# Altium project QAM16.PrjPcb (part 3 of 3)
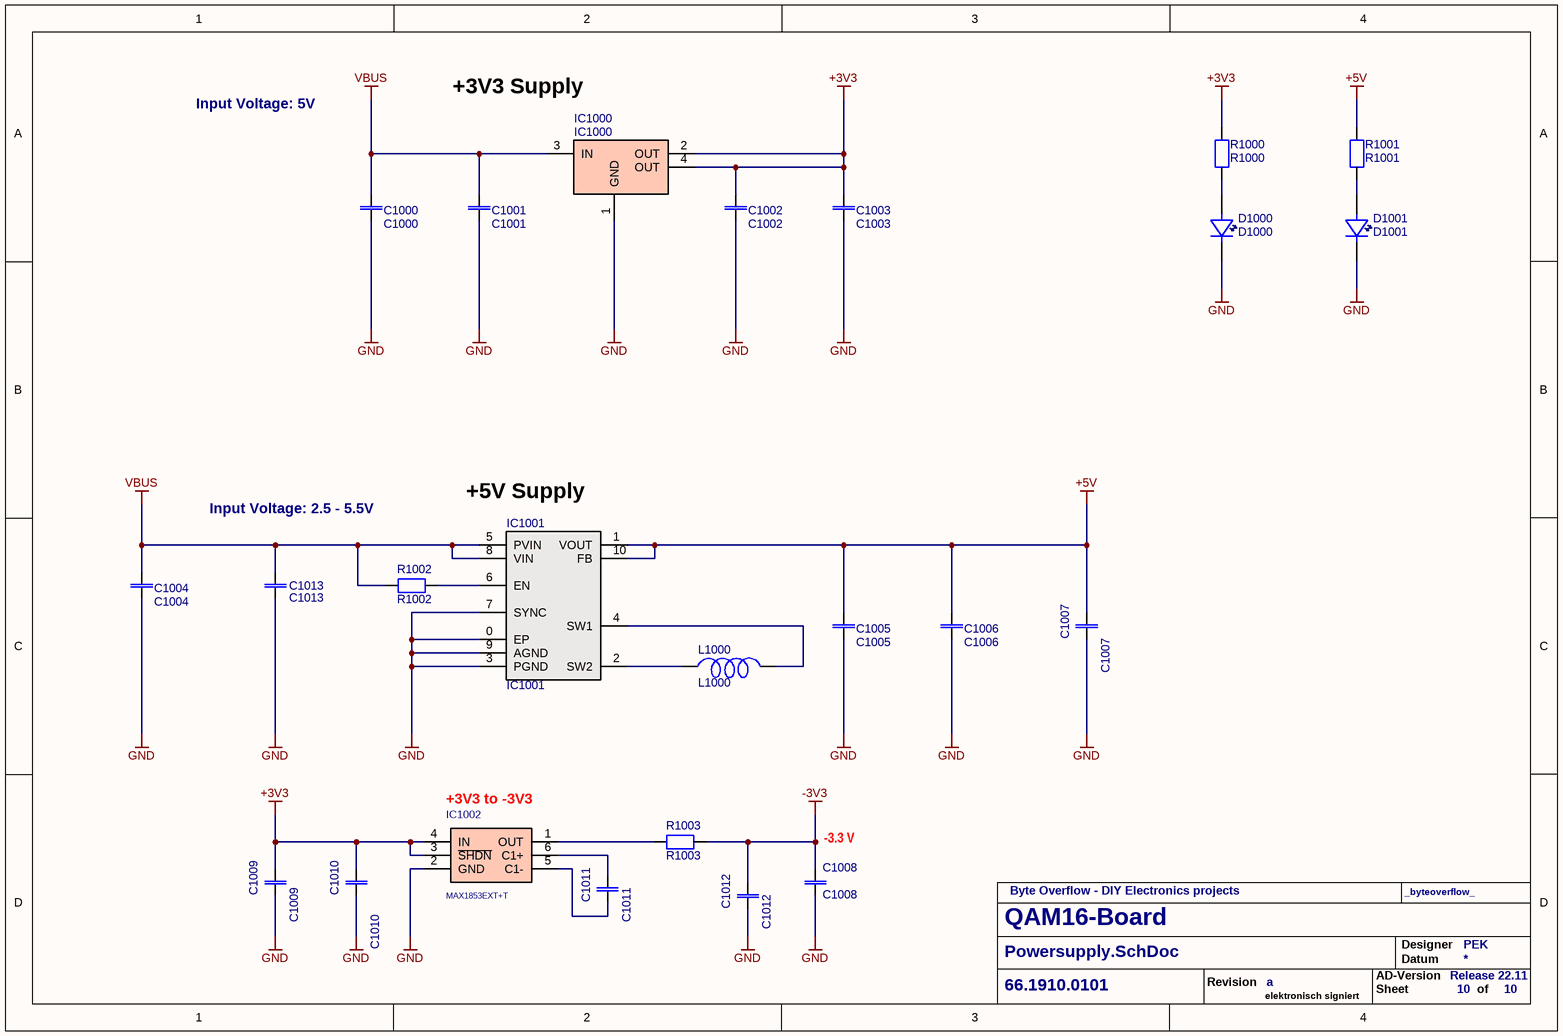
[diagram p10: Powersupply.SchDoc]

## Nets that join several sheets
+3V3: Buttons (R300.1 R301.1 R302.1 R303.1), Communication (C601.1 IC600.6 R602.2 R603.2), Connectors (12 pins), Display (14 pins), Sensors (5 pins), MCU (20 pins), Powersupply (9 pins)
+5V: ADC (R901.1), Connectors (D704.2 FE709.1 TP701.1), DAC (C810.1 FE801.2), MCU (C211.1 C213.1 IC201.1 IC203.14), Powersupply (6 pins)
+5V_AVCC: ADC (IC900.4), DAC (6 pins)
-3V3: DAC (C803.1 FE800.2), Powersupply (C1008.1 C1012.1 R1003.2)
-3V3_AVCC: ADC (IC900.11), Connectors (TP705.1), DAC (6 pins)
GND: MasterSheet (8 pins), ADC (C901.1 IC901.4 R908.1 R909.1), Buttons (8 pins), Communication (6 pins), Connectors (34 pins), DAC (14 pins), Display (32 pins), Sensors (5 pins), MCU (23 pins), Powersupply (21 pins)
VBUS: Communication (C600.1 IC600.7 R600.1), Connectors (6 pins), Powersupply (8 pins)
ADC_IN5: ADC (C900.2 IC900.8 R907.1), MCU (IC200.10)
ADC_IN6: DAC (R807.1), MCU (IC200.11)
BME_CS: Sensors (IC500.2), MCU (IC200.18)
BTN1: Buttons (C300.1 R304.2), MCU (IC200.38)
BTN2: Buttons (C301.1 R305.2), MCU (IC200.39)
BTN3: Buttons (C302.1 R306.2), MCU (IC200.40)
BTN4: Buttons (C303.1 R307.2), MCU (IC200.41)
DAC1_OUT: DAC (C801.1), MCU (IC200.14)
DISP_BL: Display (R406.2), MCU (IC200.25)
DISP_CS: Display (R401.2), MCU (IC200.29)
DISP_DC: Display (R400.2), MCU (IC200.31)
DISP_RST: Display (R405.2), MCU (IC200.30)
I2C1_SCL: Connectors (D700.2 FE704.1 R704.2), Sensors (IC501.2), MCU (IC200.45)
I2C1_SDA: Connectors (D700.1 FE703.1 R703.2), Sensors (IC501.1), MCU (IC200.46)
LED1: Connectors (R718.1 T702.1), MCU (R203.2)
LED2: Connectors (R719.1 T701.1), MCU (R203.4)
LED3: Connectors (R717.1 T700.1), MCU (R203.6)
NRST: Connectors (R709.1), MCU (C210.1 IC200.7)
SIG_IN: ADC (R904.1), Connectors (R706.2 R707.2)
SIG_OUT: Connectors (R705.2 R708.2), DAC (IC800.6 IC800.7 R806.2 R807.2)
SPI1_MISO: Sensors (IC500.5), MCU (IC200.16 IC202.2)
SPI1_MOSI: Sensors (IC500.3), MCU (IC200.17 IC202.5)
SPI1_SCK: Sensors (IC500.4), MCU (IC200.15 IC202.6)
SPI2_MOSI: Display (R404.2), MCU (IC200.28)
SPI2_SCK: Display (R403.2), MCU (IC200.26)
SWCLK: Connectors (R711.1), MCU (IC200.37)
SWDIO: Connectors (R710.1), MCU (IC200.34)
TP1: Connectors (D706.2 FE708.1 TP700.1), MCU (R206.2)
TP2: Connectors (D706.1 FE707.1 TP703.1), MCU (IC200.20)
TP4: Connectors (D701.2 FE702.1), MCU (IC200.33)
USART1_RX: Connectors (R715.1), MCU (IC200.43)
USART1_TX: Connectors (R713.1), MCU (IC200.42)
USART2_RX: Communication (IC600.18), MCU (IC200.13)
USART2_TX: Communication (IC600.17), MCU (IC200.12)
USART3_RX: Connectors (D707.2 FE712.1), MCU (IC200.22)
USART3_TX: Connectors (D707.1 FE710.1), MCU (IC200.21)
USB_D_N: Communication (IC600.5), Connectors (D702.5)
USB_D_P: Communication (IC600.4), Connectors (D702.4 R700.2)

## Assembly variants
SMD: not fitted FID100 FID101 FID102 FID103 IC201 J500 J700 J701 J702 J703 MH100 MH101 MH102 MH103 TP700 TP701 TP702 TP703 TP704 TP705 TP706 TP707 TP708 TP709 TP710 TP711
THT: not fitted C200 C201 C202 C203 C204 C205 C206 C207 C208 C209 C210 C211 C212 C213 C300 C301 C302 C303 C400 C500 C501 C600 C601 C700 C701 C702 C800 C801 C802 C803 C804 C805 C806 C807 C810 C811 C812 C813 C814 C900 C901 C1000 C1001 C1002 C1003 C1004 C1005 C1006 C1007 C1008 C1009 C1010 C1011 C1012 C1013 D600 D601 D700 D701 D702 D703 D704 D705 D706 D707 D708 D709 D710 D1000 D1001 FE700 FE701 FE702 FE703 FE704 FE705 FE706 FE707 FE708 FE709 FE710 FE711 FE712 FE713 FE714 FE715 FE716 FE717 FE800 FE801 FID100 FID101 FID102 FID103 IC200 IC201 IC202 IC203 IC500 IC600 IC800 IC900 IC901 IC1000 IC1001 IC1002 J700 J704 KEY300 KEY301 KEY302 KEY303 L200 L1000 LCD400 MH100 MH101 MH102 MH103 R200 R201 R202 R203 R204 R205 R206 R300 R301 R302 R303 R304 R305 R306 R307 R400 R401 R402 R403 R404 R405 R406 R407 R600 R601 R602 R603 R700 R701 R702 R703 R704 R705 R706 R707 R708 R709 R710 R711 R712 R713 R714 R715 R716 R717 R718 R719 R800 R801 R802 R803 R804 R805 R806 R807 R900 R901 R902 R903 R904 R905 R906 R907 R908 R909 R1000 R1001 R1002 R1003 T400 T700 T701 T702